# Altium schematic sheet InterlockDraftSch.SchDoc
size A
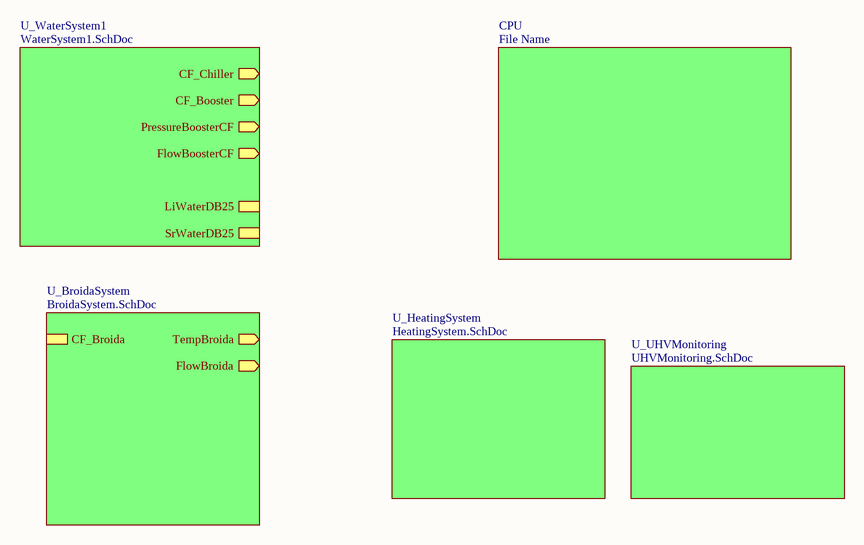
[diagram p0: InterlockDraftSch.SchDoc]

## Sub-sheets
CPU = File Name: no entries
U_BroidaSystem = BroidaSystem.SchDoc: CF_Broida, TempBroida (out), FlowBroida (out)
U_HeatingSystem = HeatingSystem.SchDoc: no entries
U_UHVMonitoring = UHVMonitoring.SchDoc: no entries
U_WaterSystem1 = WaterSystem1.SchDoc: CF_Chiller (out), CF_Booster (out), PressureBoosterCF (out), FlowBoosterCF (out), LiWaterDB25 (harness *), SrWaterDB25 (harness *)